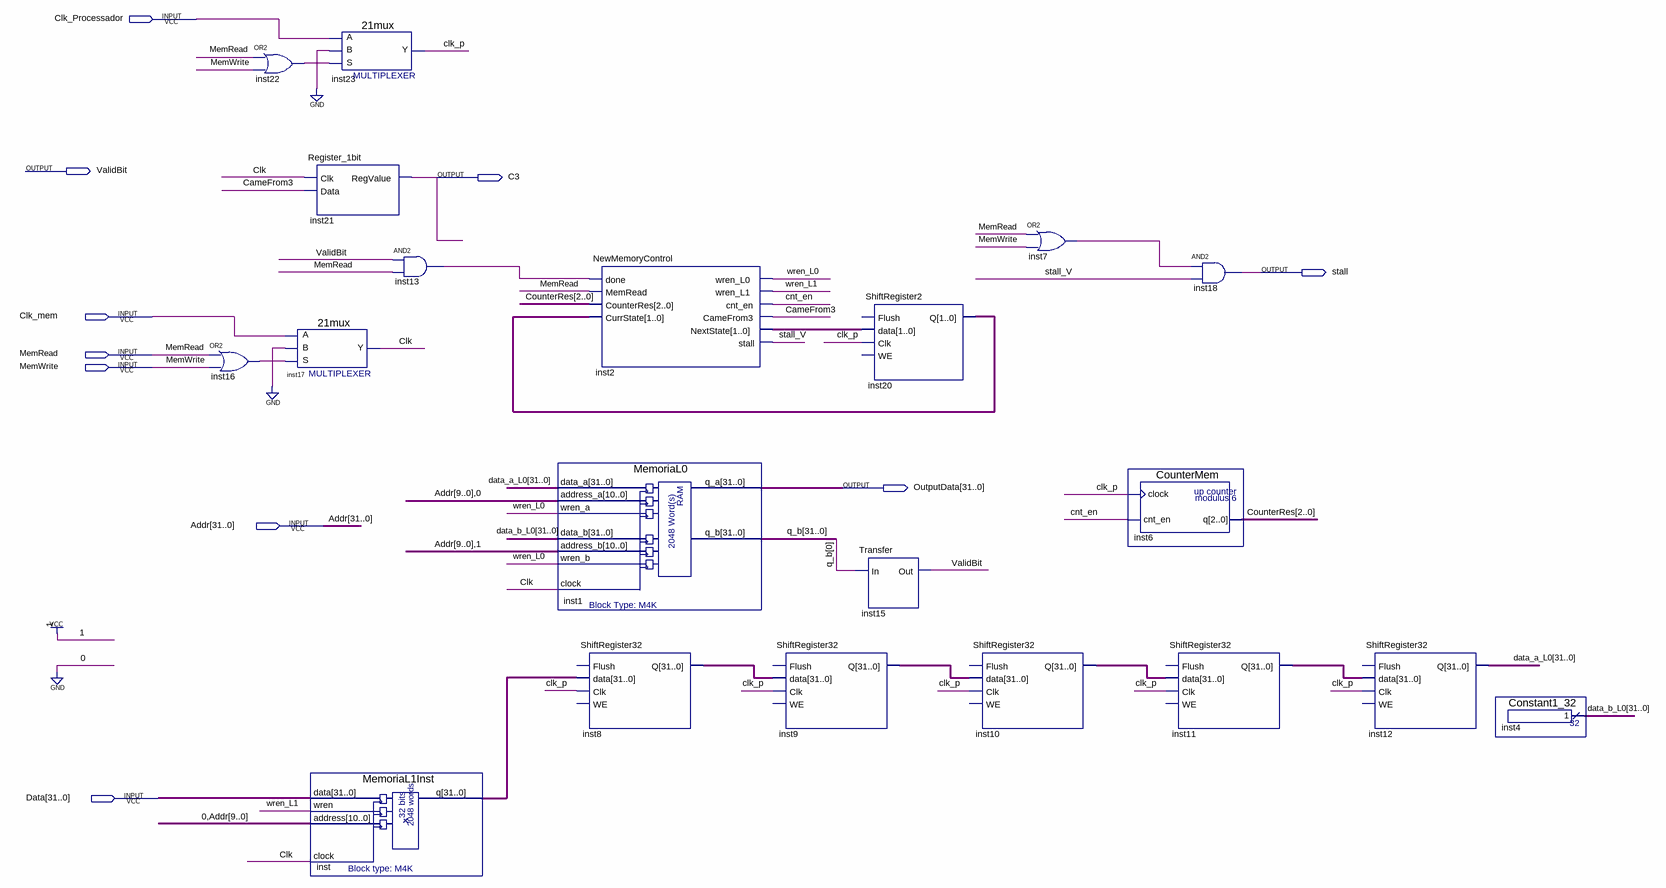
[diagram p0: schematic sheet]
// Quartus schematic MemoriaInstrucoes.bdf as structural Verilog: 20 symbols, 10 pins
module MemoriaInstrucoes (
  input  Clk_Processador,
  input  Clk_mem,
  input  MemRead,
  input  MemWrite,
  input  [31:0] Addr,
  input  [31:0] Data,
  output ValidBit,
  output C3,
  output stall,
  output [31:0] OutputData
);

  wire CameFrom3, Clk, clk_p, cnt_en, inst7_out, inst13_out, inst16_out, inst22_out, stall_V, wren_L0,
       wren_L1;
  wire [1:0] inst2_nextstate, inst20_q;
  wire [2:0] CounterRes;
  wire [31:0] data_a_L0, data_b_L0, inst8_q, inst9_q, inst10_q, inst11_q, inst_q, q_b;

  or inst16 (inst16_out, MemRead, MemWrite);
  or inst22 (inst22_out, MemRead, MemWrite);
  Register_1bit inst21 (.Clk(Clk), .Data(CameFrom3), .RegValue(C3));
  \21mux  inst17 (.S(inst16_out), .B(1'b0), .A(Clk_mem), .Y(Clk));
  MemoriaL1Inst inst (.data(Data), .wren(wren_L1), .address({1'b0, Addr[9:0]}), .clock(Clk), .q(inst_q));
  \21mux  inst23 (.S(inst22_out), .B(1'b0), .A(Clk_Processador), .Y(clk_p));
  and inst13 (inst13_out, ValidBit, MemRead);
  MemoriaL0 inst1 (
    .data_a(data_a_L0), .address_a({Addr[9:0], 1'b0}), .wren_a(wren_L0), .data_b(data_b_L0),
    .address_b({Addr[9:0], 1'b1}), .wren_b(wren_L0), .clock(Clk), .q_a(OutputData), .q_b(q_b));
  NewMemoryControl inst2 (
    .done(inst13_out), .MemRead(MemRead), .CounterRes(CounterRes), .CurrState(inst20_q), .wren_L0(wren_L0),
    .wren_L1(wren_L1), .cnt_en(cnt_en), .CameFrom3(CameFrom3), .NextState(inst2_nextstate), .stall(stall_V));
  ShiftRegister32 inst8 (.data(inst_q), .Clk(clk_p), .Q(inst8_q));  // open: Flush, WE
  ShiftRegister32 inst9 (.data(inst8_q), .Clk(clk_p), .Q(inst9_q));  // open: Flush, WE
  ShiftRegister2 inst20 (.data(inst2_nextstate), .Clk(clk_p), .Q(inst20_q));  // open: Flush, WE
  Transfer inst15 (.In(q_b[0]), .Out(ValidBit));
  ShiftRegister32 inst10 (.data(inst9_q), .Clk(clk_p), .Q(inst10_q));  // open: Flush, WE
  or inst7 (inst7_out, MemRead, MemWrite);
  CounterMem inst6 (.clock(clk_p), .cnt_en(cnt_en), .q(CounterRes));
  ShiftRegister32 inst11 (.data(inst10_q), .Clk(clk_p), .Q(inst11_q));  // open: Flush, WE
  and inst18 (stall, inst7_out, stall_V);
  ShiftRegister32 inst12 (.data(inst11_q), .Clk(clk_p), .Q(data_a_L0));  // open: Flush, WE
  Constant1_32 inst4 (.result(data_b_L0));
endmodule
